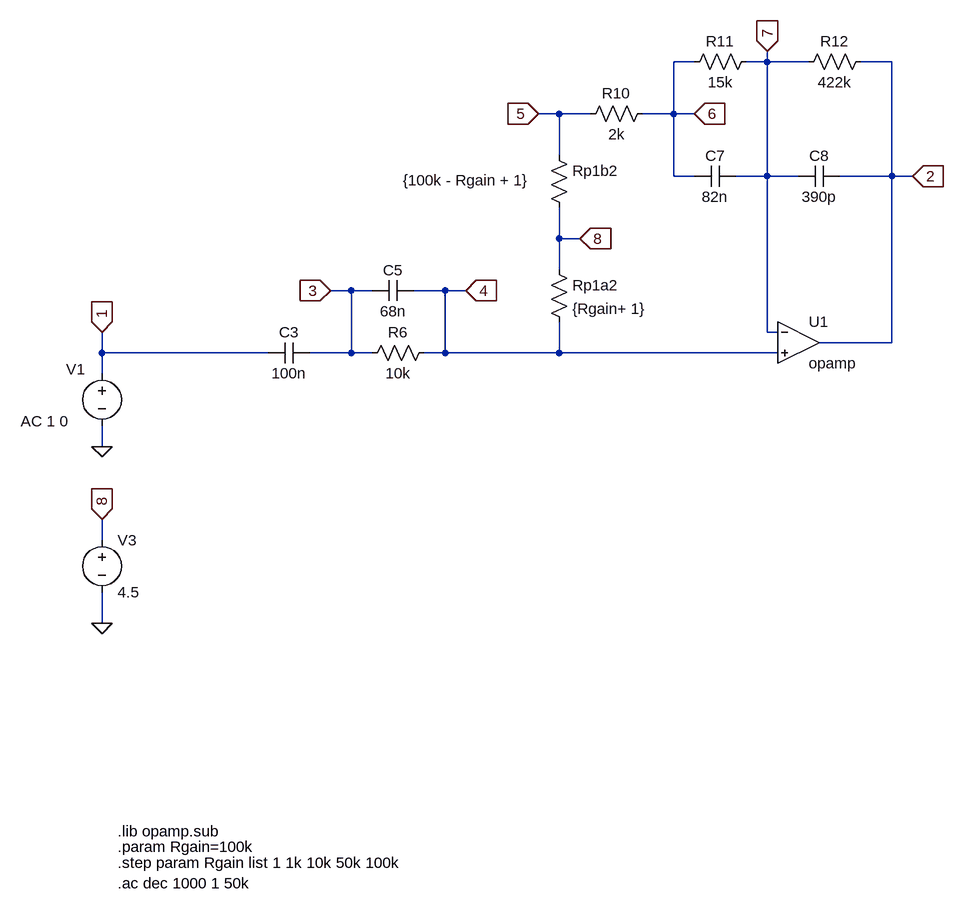
[diagram p0: schematic Klon-Centaur_clipped_path-OLD.asc]
Klon-Centaur_clipped_path-OLD.asc, the LTspice schematic file:
Version 4
SHEET 1 4496 5064
WIRE 496 2112 464 2112
WIRE 608 2112 608 2096
WIRE 608 2112 576 2112
WIRE 672 2112 608 2112
WIRE 800 2112 752 2112
WIRE 288 2192 256 2192
WIRE 336 2192 288 2192
WIRE 464 2192 464 2112
WIRE 464 2192 416 2192
WIRE 496 2192 464 2192
WIRE 288 2256 288 2192
WIRE 464 2288 464 2192
WIRE 496 2288 464 2288
WIRE 608 2288 608 2112
WIRE 608 2288 560 2288
WIRE 656 2288 608 2288
WIRE 800 2288 800 2112
WIRE 800 2288 720 2288
WIRE 832 2288 800 2288
WIRE 288 2384 288 2336
WIRE 320 2384 288 2384
WIRE 288 2432 288 2384
WIRE -32 2464 -64 2464
WIRE 0 2464 -32 2464
WIRE 112 2464 64 2464
WIRE 144 2464 112 2464
WIRE 608 2528 608 2288
WIRE 624 2528 608 2528
WIRE 800 2544 800 2288
WIRE 800 2544 688 2544
WIRE -416 2560 -416 2528
WIRE -160 2560 -416 2560
WIRE -32 2560 -32 2464
WIRE -32 2560 -96 2560
WIRE 0 2560 -32 2560
WIRE 112 2560 112 2464
WIRE 112 2560 80 2560
WIRE 288 2560 288 2512
WIRE 288 2560 112 2560
WIRE 624 2560 288 2560
WIRE -416 2592 -416 2560
WIRE -416 2704 -416 2672
WIRE -416 2848 -416 2816
WIRE -416 2976 -416 2928
FLAG -416 2528 1
IOPIN -416 2528 In
FLAG 320 2384 8
IOPIN 320 2384 In
FLAG -416 2976 0
FLAG -416 2816 8
IOPIN -416 2816 In
FLAG -416 2704 0
FLAG -64 2464 3
IOPIN -64 2464 In
FLAG 144 2464 4
IOPIN 144 2464 In
FLAG 256 2192 5
IOPIN 256 2192 In
FLAG 496 2192 6
IOPIN 496 2192 In
FLAG 608 2096 7
IOPIN 608 2096 In
FLAG 832 2288 2
IOPIN 832 2288 In
SYMBOL voltage -416 2576 R0
WINDOW 0 -55 9 Left 2
WINDOW 123 -125 89 Left 2
WINDOW 39 0 0 Left 0
WINDOW 3 -289 58 Left 2
SYMATTR InstName V1
SYMATTR Value2 AC 1 0
SYMATTR Value ""
SYMBOL cap -96 2544 R90
WINDOW 0 0 32 VBottom 2
WINDOW 3 32 32 VTop 2
SYMATTR InstName C3
SYMATTR Value 100n
SYMBOL res 96 2544 R90
WINDOW 0 0 56 VBottom 2
WINDOW 3 32 56 VTop 2
SYMATTR InstName R6
SYMATTR Value 10k
SYMBOL cap 64 2448 R90
WINDOW 0 0 32 VBottom 2
WINDOW 3 32 32 VTop 2
SYMATTR InstName C5
SYMATTR Value 68n
SYMBOL res 272 2240 R0
WINDOW 3 -225 54 Left 2
SYMATTR Value {100k - Rgain + 1}
SYMATTR InstName Rp1b2
SYMBOL res 272 2416 R0
SYMATTR InstName Rp1a2
SYMATTR Value {Rgain+ 1}
SYMBOL res 432 2176 R90
WINDOW 0 0 56 VBottom 2
WINDOW 3 32 56 VTop 2
SYMATTR InstName R10
SYMATTR Value 2k
SYMBOL res 592 2096 R90
WINDOW 0 0 56 VBottom 2
WINDOW 3 32 56 VTop 2
SYMATTR InstName R11
SYMATTR Value 15k
SYMBOL cap 560 2272 R90
WINDOW 0 0 32 VBottom 2
WINDOW 3 32 32 VTop 2
SYMATTR InstName C7
SYMATTR Value 82n
SYMBOL cap 720 2272 R90
WINDOW 0 0 32 VBottom 2
WINDOW 3 32 32 VTop 2
SYMATTR InstName C8
SYMATTR Value 390p
SYMBOL res 768 2096 R90
WINDOW 0 0 56 VBottom 2
WINDOW 3 32 56 VTop 2
SYMATTR InstName R12
SYMATTR Value 422k
SYMBOL voltage -416 2832 R0
WINDOW 123 0 0 Left 0
WINDOW 39 0 0 Left 0
SYMATTR InstName V3
SYMATTR Value 4.5
SYMBOL OpAmps\\opamp 656 2480 R0
SYMATTR InstName U1
TEXT -392 3320 Left 2 !.param Rgain=100k
TEXT -392 3296 Left 2 !.lib opamp.sub
TEXT -392 3344 Left 2 !.step param Rgain list 1 1k 10k 50k 100k
TEXT -392 3376 Left 2 !.ac dec 1000 1 50k

The netlist it stands for:
* Klon-Centaur_clipped_path-OLD.asc
V1 1 0 AC 1 0
C3 3 1 100n
R6 4 3 10k
C5 4 3 68n
Rp1b2 5 8 {100k - Rgain + 1}
Rp1a2 8 4 {Rgain+ 1}
R10 6 5 2k
R11 7 6 15k
C7 7 6 82n
C8 2 7 390p
R12 2 7 422k
V3 8 0 4.5
XU1 7 4 2 opamp Aol=100K GBW=10Meg  ; pins invin noninvin out
.param Rgain=100k
.lib opamp.sub
.step param Rgain list 1 1k 10k 50k 100k
.ac dec 1000 1 50k
.backanno
.end